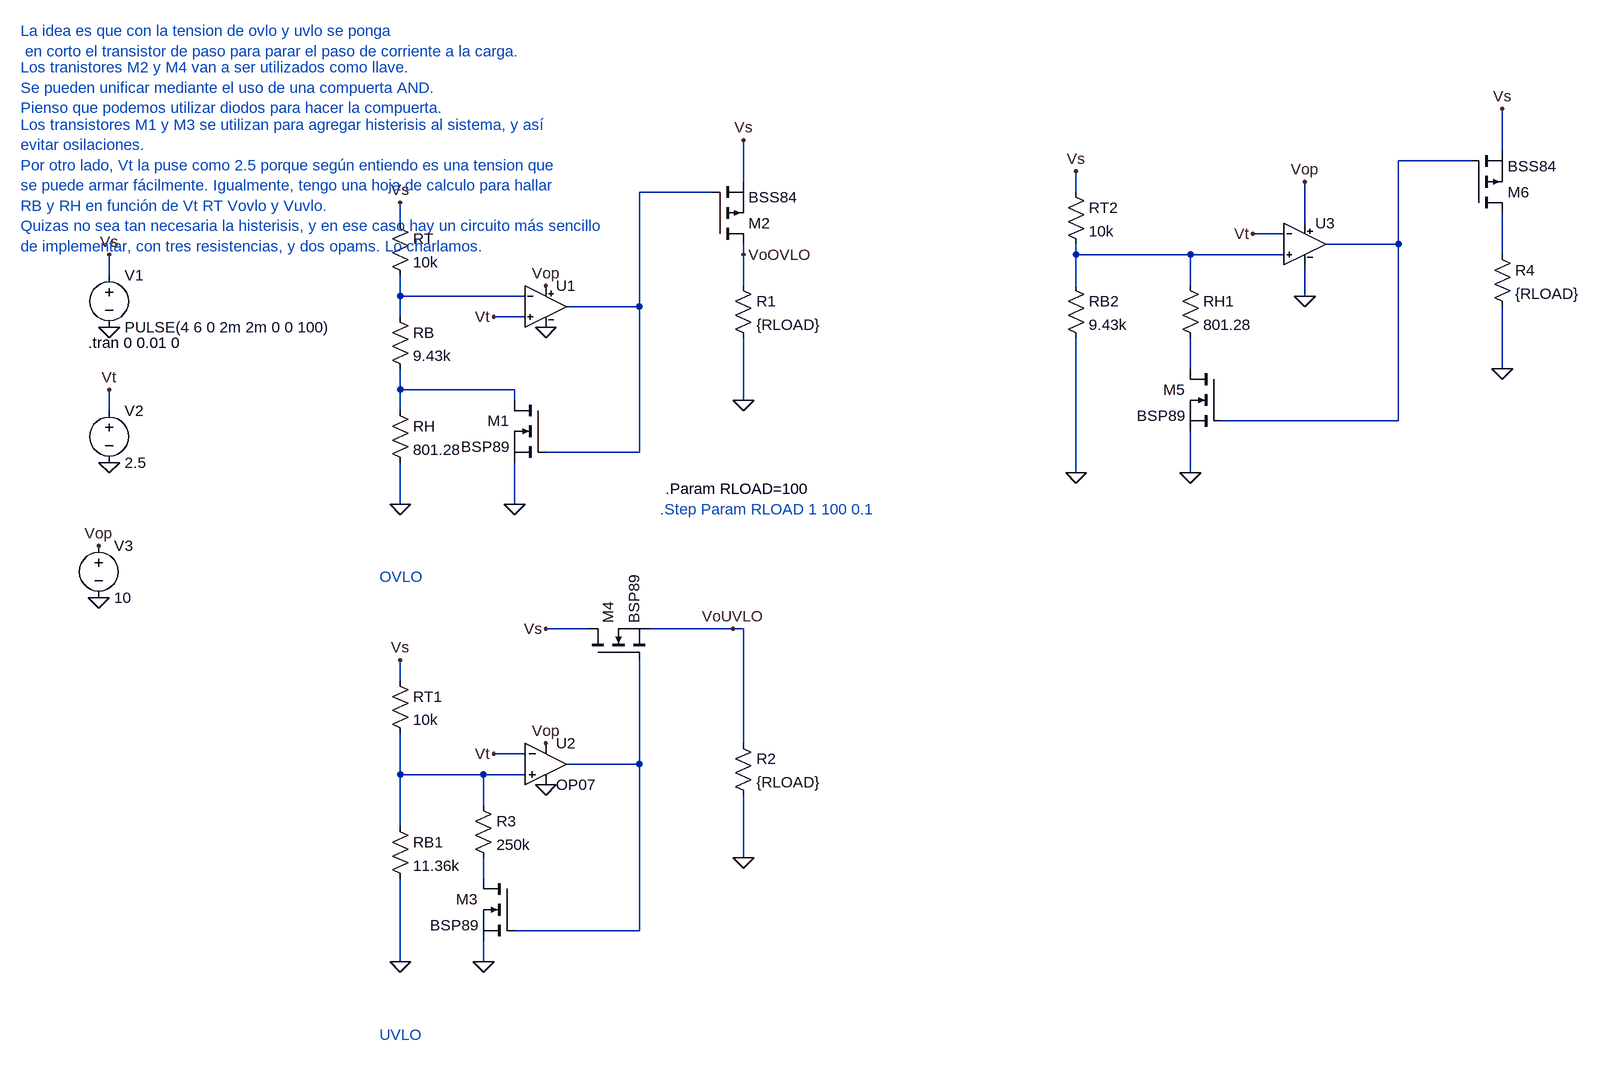
[diagram p0: schematic OVLO UVLO.asc]
OVLO UVLO.asc, the LTspice schematic file:
Version 4
SHEET 1 2364 1312
WIRE 2144 -64 2144 -128
WIRE 2096 -48 1984 -48
WIRE 976 -16 976 -80
WIRE 928 0 816 0
WIRE 1488 0 1488 -32
WIRE 448 48 448 16
WIRE 1840 48 1840 -16
WIRE 1808 64 1760 64
WIRE 1984 80 1984 -48
WIRE 1984 80 1872 80
WIRE 976 96 976 80
WIRE 1488 96 1488 80
WIRE 1664 96 1488 96
WIRE 1808 96 1664 96
WIRE 2144 96 2144 32
WIRE 0 128 0 96
WIRE 976 144 976 96
WIRE 1488 144 1488 96
WIRE 1664 144 1664 96
WIRE 448 160 448 128
WIRE 640 160 448 160
WIRE 1840 160 1840 112
WIRE 816 176 816 0
WIRE 816 176 704 176
WIRE 448 192 448 160
WIRE 640 192 592 192
WIRE 1664 272 1664 224
WIRE 2144 272 2144 176
WIRE 448 304 448 272
WIRE 624 304 448 304
WIRE 624 320 624 304
WIRE 976 320 976 224
WIRE 0 336 0 304
WIRE 448 336 448 304
WIRE 1984 352 1984 80
WIRE 1984 352 1712 352
WIRE 816 400 816 176
WIRE 816 400 672 400
WIRE 1488 432 1488 224
WIRE 1664 432 1664 368
WIRE 448 480 448 416
WIRE 624 480 624 416
WIRE 736 672 672 672
WIRE 960 672 832 672
WIRE 976 672 960 672
WIRE 448 752 448 720
WIRE 976 848 976 672
WIRE 640 864 592 864
WIRE 816 880 816 720
WIRE 816 880 704 880
WIRE 448 896 448 832
WIRE 576 896 448 896
WIRE 640 896 576 896
WIRE 576 944 576 896
WIRE 448 976 448 896
WIRE 976 1024 976 928
WIRE 576 1056 576 1024
WIRE 816 1136 816 880
WIRE 816 1136 624 1136
WIRE 448 1184 448 1056
WIRE 576 1184 576 1152
FLAG 0 208 0
FLAG 672 208 0
FLAG 0 96 Vs
FLAG 448 480 0
FLAG 624 480 0
FLAG 448 16 Vs
FLAG 976 96 VoOVLO
FLAG 0 416 0
FLAG 0 304 Vt
FLAG 976 320 0
FLAG -16 624 0
FLAG -16 544 Vop
FLAG 672 144 Vop
FLAG 592 192 Vt
FLAG 672 912 0
FLAG 448 1184 0
FLAG 576 1184 0
FLAG 448 720 Vs
FLAG 672 672 Vs
FLAG 960 672 VoUVLO
FLAG 976 1024 0
FLAG 672 848 Vop
FLAG 592 864 Vt
FLAG 976 -80 Vs
FLAG 1840 160 0
FLAG 1488 432 0
FLAG 1664 432 0
FLAG 1488 -32 Vs
FLAG 2144 272 0
FLAG 1840 -16 Vop
FLAG 1760 64 Vt
FLAG 2144 -128 Vs
SYMBOL voltage 0 112 R0
WINDOW 123 0 0 Left 0
WINDOW 39 0 0 Left 0
SYMATTR InstName V1
SYMATTR Value PULSE(4 6 0 2m 2m 0 0 100)
SYMBOL res 432 32 R0
SYMATTR InstName RT
SYMATTR Value 10k
SYMBOL res 432 176 R0
SYMATTR InstName RB
SYMATTR Value 9.43k
SYMBOL res 432 320 R0
SYMATTR InstName RH
SYMATTR Value 801.28
SYMBOL nmos 672 320 M0
SYMATTR InstName M1
SYMATTR Value BSP89
SYMBOL voltage 0 320 R0
WINDOW 123 0 0 Left 0
WINDOW 39 0 0 Left 0
SYMATTR InstName V2
SYMATTR Value 2.5
SYMBOL res 960 128 R0
SYMATTR InstName R1
SYMATTR Value {RLOAD}
SYMBOL voltage -16 528 R0
WINDOW 123 0 0 Left 0
WINDOW 39 0 0 Left 0
SYMATTR InstName V3
SYMATTR Value 10
SYMBOL OpAmps\\OP07 672 816 R0
SYMATTR InstName U2
SYMBOL res 432 736 R0
SYMATTR InstName RT1
SYMATTR Value 10k
SYMBOL res 432 960 R0
SYMATTR InstName RB1
SYMATTR Value 11.36k
SYMBOL nmos 624 1056 M0
SYMATTR InstName M3
SYMATTR Value BSP89
SYMBOL nmos 736 720 R270
SYMATTR InstName M4
SYMATTR Value BSP89
SYMBOL res 960 832 R0
SYMATTR InstName R2
SYMATTR Value {RLOAD}
SYMBOL res 560 928 R0
SYMATTR InstName R3
SYMATTR Value 250k
SYMBOL lm324 672 176 R0
SYMATTR InstName U1
SYMBOL pmos 928 80 M180
SYMATTR InstName M2
SYMATTR Value BSS84
SYMBOL res 1472 -16 R0
SYMATTR InstName RT2
SYMATTR Value 10k
SYMBOL res 1472 128 R0
SYMATTR InstName RB2
SYMATTR Value 9.43k
SYMBOL res 1648 128 R0
SYMATTR InstName RH1
SYMATTR Value 801.28
SYMBOL nmos 1712 272 M0
SYMATTR InstName M5
SYMATTR Value BSP89
SYMBOL res 2128 80 R0
SYMATTR InstName R4
SYMATTR Value {RLOAD}
SYMBOL lm324 1840 80 R0
SYMATTR InstName U3
SYMBOL pmos 2096 32 M180
SYMATTR InstName M6
SYMATTR Value BSS84
TEXT -32 232 Left 2 !.tran 0 0.01 0
TEXT 416 592 Left 2 ;OVLO
TEXT 848 488 Left 2 ;.Step Param RLOAD 1 100 0.1
TEXT 416 1296 Left 2 ;UVLO
TEXT 856 456 Left 2 !.Param RLOAD=100
TEXT -136 -248 Left 2 ;La idea es que con la tension de ovlo y uvlo se ponga\n en corto el transistor de paso para parar el paso de corriente a la carga.
TEXT -136 -192 Left 2 ;Los tranistores M2 y M4 van a ser utilizados como llave.\nSe pueden unificar mediante el uso de una compuerta AND.\nPienso que podemos utilizar diodos para hacer la compuerta.
TEXT -136 -104 Left 2 ;Los transistores M1 y M3 se utilizan para agregar histerisis al sistema, y así \nevitar osilaciones.\nPor otro lado, Vt la puse como 2.5 porque según entiendo es una tension que \nse puede armar fácilmente. Igualmente, tengo una hoja de calculo para hallar\nRB y RH en función de Vt RT Vovlo y Vuvlo. \nQuizas no sea tan necesaria la histerisis, y en ese caso hay un circuito más sencillo \nde implementar, con tres resistencias, y dos opams. Lo charlamos.

The netlist it stands for:
* OVLO UVLO.asc
V1 Vs 0 PULSE(4 6 0 2m 2m 0 0 100)
RT Vs N005 10k
RB N005 N007 9.43k
RH N007 0 801.28
M1 N007 N002 0 0 BSP89
V2 Vt 0 2.5
R1 VoOVLO 0 {RLOAD}
V3 Vop 0 10
XU2 N009 Vt Vop 0 N008 LT1001  ; OP07, pins In+ In- V+ V- OUT
RT1 Vs N009 10k
RB1 N009 0 11.36k
M3 N010 N008 0 0 BSP89
M4 Vs N008 VoUVLO VoUVLO BSP89
R2 VoUVLO 0 {RLOAD}
R3 N009 N010 250k
XU1 Vt N005 Vop 0 N002 LM324  ; pins In+ In- V+ V- OUT
M2 VoOVLO N002 Vs Vs BSS84
RT2 Vs N003 10k
RB2 N003 0 9.43k
RH1 N003 N006 801.28
M5 N006 N001 0 0 BSP89
R4 N004 0 {RLOAD}
XU3 N003 Vt Vop 0 N001 LM324  ; pins In+ In- V+ V- OUT
M6 N004 N001 Vs Vs BSS84
.model NMOS NMOS
.model PMOS PMOS
.lib standard.mos
.tran 0 0.01 0
* OVLO
* .Step Param RLOAD 1 100 0.1
* UVLO
.Param RLOAD=100
* La idea es que con la tension de ovlo y uvlo se ponga
*  en corto el transistor de paso para parar el paso de corriente a la carga.
* Los tranistores M2 y M4 van a ser utilizados como llave.
* Se pueden unificar mediante el uso de una compuerta AND.
* Pienso que podemos utilizar diodos para hacer la compuerta.
* Los transistores M1 y M3 se utilizan para agregar histerisis al sistema, y así
* evitar osilaciones.
* Por otro lado, Vt la puse como 2.5 porque según entiendo es una tension que
* se puede armar fácilmente. Igualmente, tengo una hoja de calculo para hallar
* RB y RH en función de Vt RT Vovlo y Vuvlo.
* Quizas no sea tan necesaria la histerisis, y en ese caso hay un circuito más sencillo
* de implementar, con tres resistencias, y dos opams. Lo charlamos.
.lib LTC.lib
.lib LM324.lib
.backanno
.end